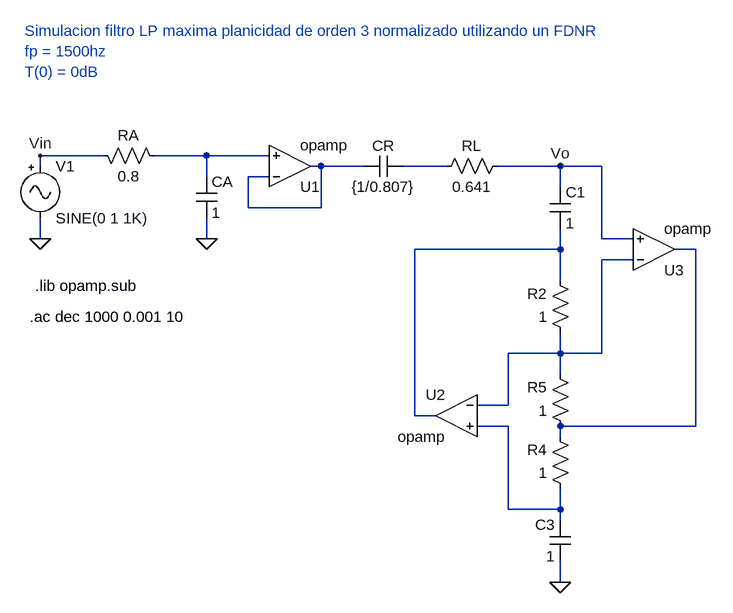
[diagram p0: schematic ts_3_fndr_normalizado.asc]
ts_3_fndr_normalizado.asc, the LTspice schematic file:
Version 4
SHEET 1 948 704
WIRE -288 32 -384 32
WIRE -128 32 -208 32
WIRE -32 32 -128 32
WIRE -384 48 -384 32
WIRE 48 48 32 48
WIRE 112 48 48 48
WIRE 240 48 176 48
WIRE 416 48 320 48
WIRE 480 48 416 48
WIRE -128 64 -128 32
WIRE -32 64 -64 64
WIRE 416 80 416 48
WIRE -64 112 -64 64
WIRE 48 112 48 48
WIRE 48 112 -64 112
WIRE -384 160 -384 128
WIRE -128 160 -128 128
WIRE 480 160 480 48
WIRE 528 160 480 160
WIRE 416 176 416 144
WIRE 416 176 192 176
WIRE 624 176 592 176
WIRE 528 192 480 192
WIRE 416 224 416 176
WIRE 416 336 416 304
WIRE 416 336 336 336
WIRE 480 336 480 192
WIRE 480 336 416 336
WIRE 416 368 416 336
WIRE 336 416 336 336
WIRE 336 416 288 416
WIRE 192 432 192 176
WIRE 224 432 192 432
WIRE 336 448 288 448
WIRE 624 448 624 176
WIRE 624 448 416 448
WIRE 416 464 416 448
WIRE 336 576 336 448
WIRE 416 576 416 544
WIRE 416 576 336 576
WIRE 416 592 416 576
WIRE 416 688 416 656
FLAG -384 160 0
FLAG -384 32 Vin
FLAG 416 48 Vo
FLAG -128 160 0
FLAG 416 688 0
SYMBOL res -192 48 M270
WINDOW 0 32 56 VTop 2
WINDOW 3 0 56 VBottom 2
SYMATTR InstName RA
SYMATTR Value 0.8
SYMBOL Misc/signal -384 32 R0
SYMATTR InstName V1
SYMATTR Value2 AC 1
SYMBOL cap -144 64 R0
SYMATTR InstName CA
SYMATTR Value 1
SYMBOL cap 400 80 R0
SYMATTR InstName C1
SYMATTR Value 1
SYMBOL res 432 560 R180
WINDOW 0 36 76 Left 2
WINDOW 3 36 40 Left 2
SYMATTR InstName R4
SYMATTR Value 1
SYMBOL Opamps/opamp 0 112 M180
SYMATTR InstName U1
SYMBOL Opamps/opamp 256 368 M0
SYMATTR InstName U2
SYMBOL Opamps/opamp 560 240 M180
SYMATTR InstName U3
SYMBOL res 336 32 R90
WINDOW 0 0 56 VBottom 2
WINDOW 3 32 56 VTop 2
SYMATTR InstName RL
SYMATTR Value 0.641
SYMBOL res 432 464 R180
WINDOW 0 36 76 Left 2
WINDOW 3 36 40 Left 2
SYMATTR InstName R5
SYMATTR Value 1
SYMBOL res 432 320 R180
WINDOW 0 36 76 Left 2
WINDOW 3 36 40 Left 2
SYMATTR InstName R2
SYMATTR Value 1
SYMBOL cap 432 656 R180
WINDOW 0 24 56 Left 2
WINDOW 3 24 8 Left 2
SYMATTR InstName C3
SYMATTR Value 1
SYMBOL cap 176 32 R90
WINDOW 0 0 32 VBottom 2
WINDOW 3 32 32 VTop 2
SYMATTR InstName CR
SYMATTR Value {1/0.807}
TEXT -400 280 Left 2 !.ac dec 1000 0.001 10
TEXT -392 232 Left 2 !.lib opamp.sub
TEXT -408 -160 Left 2 ;Simulacion filtro LP maxima planicidad de orden 3 normalizado utilizando un FDNR\nfp = 1500hz\nT(0) = 0dB

The netlist it stands for:
* ts_3_fndr_normalizado.asc
RA N001 Vin 0.8
V1 Vin 0 SINE(0 1 1K) AC 1
CA N001 0 1
C1 Vo N004 1
R4 N007 N005 1
XU1 N002 N001 N002 opamp Aol=100K GBW=10Meg  ; pins invin noninvin out
XU2 N006 N007 N004 opamp Aol=100K GBW=10Meg  ; pins invin noninvin out
XU3 N006 Vo N005 opamp Aol=100K GBW=10Meg  ; pins invin noninvin out
RL Vo N003 0.641
R5 N005 N006 1
R2 N006 N004 1
C3 0 N007 1
CR N003 N002 {1/0.807}
.ac dec 1000 0.001 10
.lib opamp.sub
* Simulacion filtro LP maxima planicidad de orden 3 normalizado utilizando un FDNR
* fp = 1500hz
* T(0) = 0dB
.backanno
.end